# Altium project CircleValve.PrjPCB
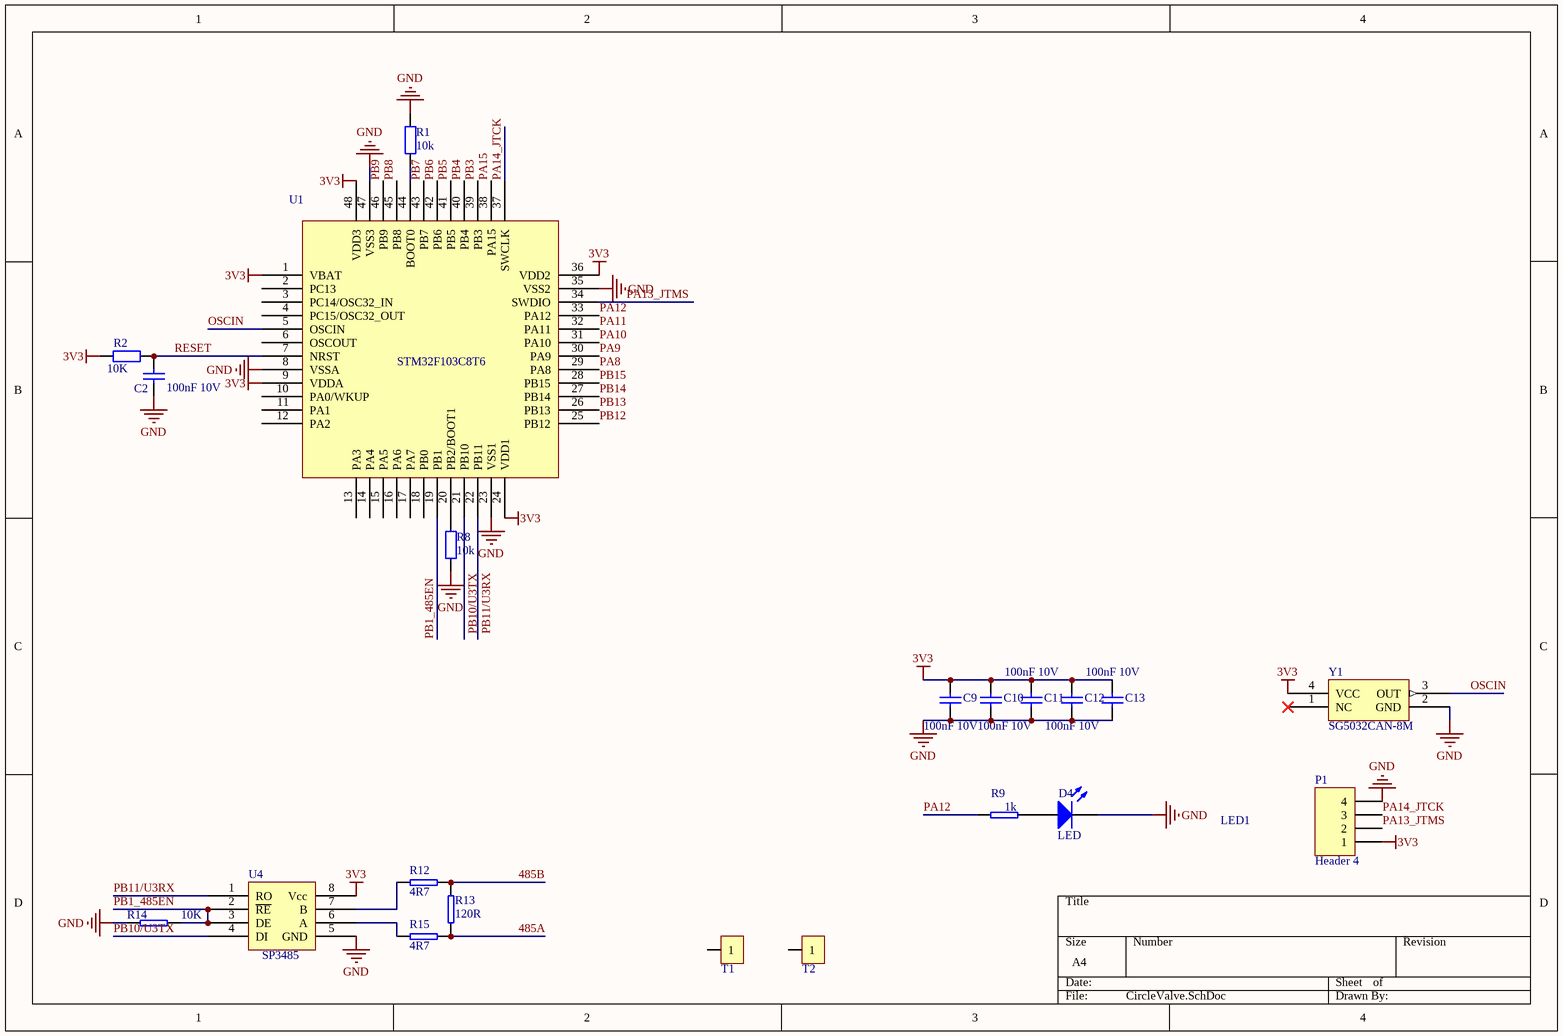
[diagram p0: CircleValve.SchDoc]
3 sheets, 53 parts. Net scope: global (net labels, ports and power ports of the same name join across sheets).
Board file: CircleValve.PcbDoc
Sheets:
  CircleValve.SchDoc
  Surface V2.0.SchDoc
  Power.SchDoc

## Sheet CircleValve.SchDoc
size A4

### Parts
C2  100nF 10V  [C0603]
C9  100nF 10V  [C0603]
C10  100nF 10V  [C0603]
C11  100nF 10V  [C0603]
C12  100nF 10V  [C0603]
C13  100nF 10V  [C0603]
D4  LED  [LED_M]
P1  Header 4  [Header4-2.54mm]
R1  10k  [R0603]
R2  10K  [R0603]
R8  10k  [R0603]
R9  1k  [R0603]
R12  4R7  [R0603]
R13  120R  [R0603]
R14  10K  [R0603]
R15  4R7  [R0603]
T1  TP  [定位孔3mm]  (value not drawn)
T2  TP  [定位孔3mm]  (value not drawn)
U1  STM32F103C8T6  [LQFP-48_7x7x05P]
U4  SP3485  [SO8]
Y1  SG5032CAN-8M  [XTAL-4P-5*3MM]

### Nets
3V3: C9.2 C10.2 C11.2 C12.2 C13.2 P1.1 R2.1 U1.1(VBAT) U1.9(VDDA) U1.24(VDD1) U1.36(VDD2) U1.48(VDD3) U4.8(Vcc) Y1.4(VCC)
GND: C2.2 C9.1 C10.1 C11.1 C12.1 C13.1 D4.2(K) P1.4 R1.2 R8.1 R14.1 U1.8(VSSA) U1.23(VSS1) U1.35(VSS2) U1.47(VSS3) U4.5(GND) Y1.2(GND)
485A: R13.2 R15.1
485B: R12.1 R13.1
OSCIN: U1.5(OSCIN) Y1.3(OUT)
PA8: U1.29(PA8)
PA9: U1.30(PA9)
PA10: U1.31(PA10)
PA11: U1.32(PA11)
PA12: R9.1 U1.33(PA12)
PA13_JTMS: P1.2 U1.34(SWDIO)
PA14_JTCK: P1.3 U1.37(SWCLK)
PA15: U1.38(PA15)
PB1_485EN: R14.2 U1.19(PB1) U4.2(~{RE}) U4.3(DE)
PB3: U1.39(PB3)
PB4: U1.40(PB4)
PB5: U1.41(PB5)
PB6: U1.42(PB6)
PB7: U1.43(PB7)
PB8: U1.45(PB8)
PB9: U1.46(PB9)
PB10/U3TX: U1.21(PB10) U4.4(DI)
PB11/U3RX: U1.22(PB11) U4.1(RO)
PB12: U1.25(PB12)
PB13: U1.26(PB13)
PB14: U1.27(PB14)
PB15: U1.28(PB15)
RESET: C2.1 R2.2 U1.7(NRST)
NetD4_1: D4.1(A) R9.2
NetR1_1: R1.1 U1.44(BOOT0)
NetR8_2: R8.2 U1.20(PB2/BOOT1)
NetR12_2: R12.2 U4.7(B)
NetR15_2: R15.2 U4.6(A)

Not connected (* = marked no-connect by the designer): T1 1; T2 1; U1 2(PC13) 3(PC14/OSC32_IN) 4(PC15/OSC32_OUT) 6(OSCOUT) 10(PA0/WKUP) 11(PA1) 12(PA2) 13(PA3) 14(PA4) 15(PA5) 16(PA6) 17(PA7) 18(PB0); Y1 1(NC)*

### Notes on the sheet
- LED1

### Library data of the parts
C2 C9-C13 = CAP
D4 = LED: 绿色
P1 = Header 4: Header, 4-Pin; LatestRevisionDate: 17-Jul-2002; LatestRevisionNote: Re-released for DXP Platform.; Publisher: Altium Limited
R1 R2 R8 = RES
R9 R12-R15 = R: 标贴电阻
U4 = RS485
Y1 = XTAL_POWER: 贴片有源晶振-8M

## Sheet Surface V2.0.SchDoc
size A4
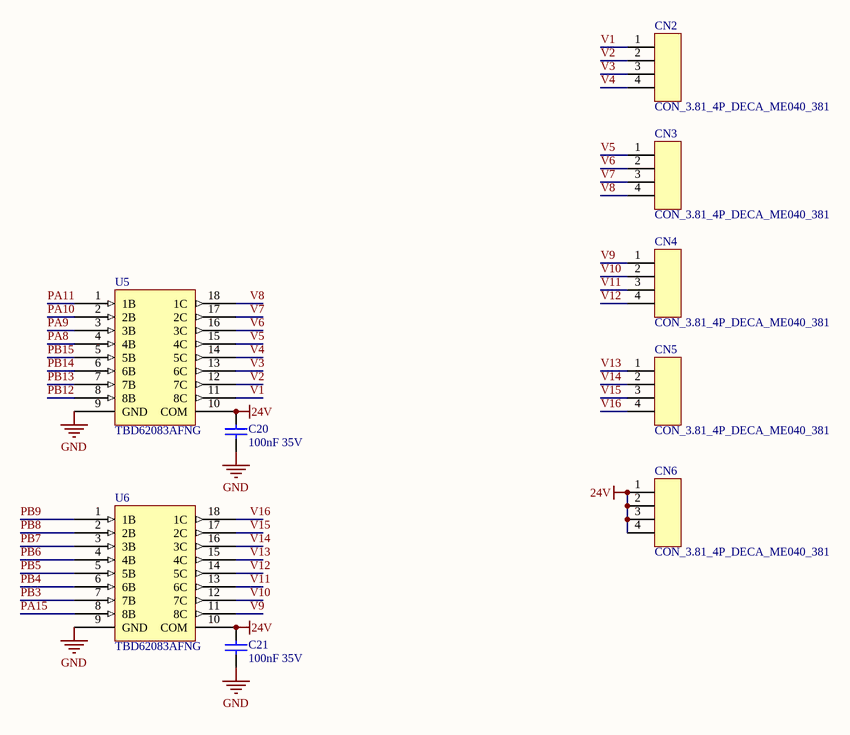
[diagram p1: Surface V2.0.SchDoc]

### Parts
C20  100nF 35V  [C0603]
C21  100nF 35V  [C0603]
CN2  CON_3.81_4P_DECA_ME040_381  [ME040_381_4P_VC-1]
CN3  CON_3.81_4P_DECA_ME040_381  [ME040_381_4P_VC-1]
CN4  CON_3.81_4P_DECA_ME040_381  [ME040_381_4P_VC-1]
CN5  CON_3.81_4P_DECA_ME040_381  [ME040_381_4P_VC-1]
CN6  CON_3.81_4P_DECA_ME040_381  [ME040_381_4P_VC-1]
U5  TBD62083AFNG  [SSOP18-0.65]
U6  TBD62083AFNG  [SSOP18-0.65]

### Nets
24V: C20.2 C21.2 CN6.1 CN6.2 CN6.3 CN6.4 U5.10(COM) U6.10(COM)
GND: C20.1 C21.1 U5.9(GND) U6.9(GND)
PA8: U5.4(4B)
PA9: U5.3(3B)
PA10: U5.2(2B)
PA11: U5.1(1B)
PA15: U6.8(8B)
PB3: U6.7(7B)
PB4: U6.6(6B)
PB5: U6.5(5B)
PB6: U6.4(4B)
PB7: U6.3(3B)
PB8: U6.2(2B)
PB9: U6.1(1B)
PB12: U5.8(8B)
PB13: U5.7(7B)
PB14: U5.6(6B)
PB15: U5.5(5B)
V1: CN2.1 U5.11(8C)
V2: CN2.2 U5.12(7C)
V3: CN2.3 U5.13(6C)
V4: CN2.4 U5.14(5C)
V5: CN3.1 U5.15(4C)
V6: CN3.2 U5.16(3C)
V7: CN3.3 U5.17(2C)
V8: CN3.4 U5.18(1C)
V9: CN4.1 U6.11(8C)
V10: CN4.2 U6.12(7C)
V11: CN4.3 U6.13(6C)
V12: CN4.4 U6.14(5C)
V13: CN5.1 U6.15(4C)
V14: CN5.2 U6.16(3C)
V15: CN5.3 U6.17(2C)
V16: CN5.4 U6.18(1C)

### Library data of the parts
C20 C21 = CAP
CN2-CN6 = CON_3.81_4P_DECA_ME040_381: DECA connector,3.81mm,1*4P,180度; PartNumber: ME040-381-4P; Manufacturer: DECA
U5 U6 = ULN2803: 达林顿晶体管阵列

## Sheet Power.SchDoc
size A4
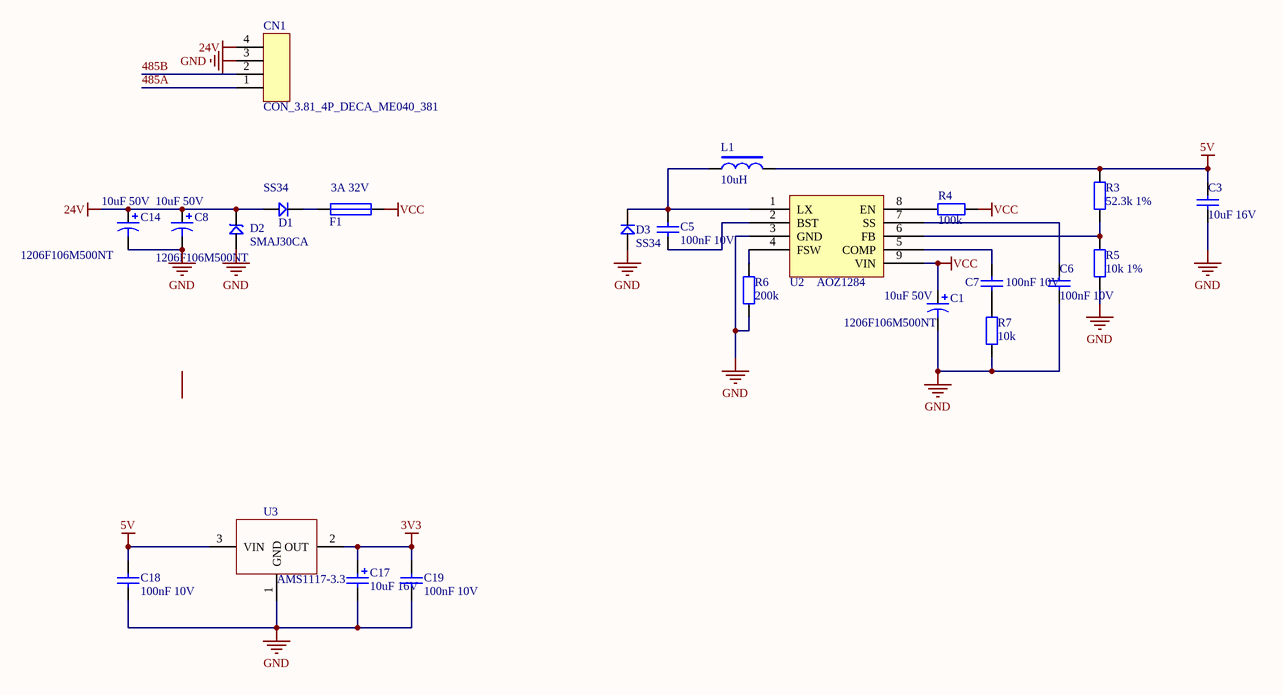
[diagram p2: Power.SchDoc]

### Parts
C1  10uF 50V  名称: 1206F106M500NT  [C1206]
C3  10uF 16V  [C1206]
C5  100nF 10V  [C0603]
C6  100nF 10V  [C0603]
C7  100nF 10V  [C0603]
C8  10uF 50V  名称: 1206F106M500NT  [C1206]
C14  10uF 50V  名称: 1206F106M500NT  [C1206]
C17  10uF 16V  [C1206]
C18  100nF 10V  [C0603]
C19  100nF 10V  [C0603]
CN1  CON_3.81_4P_DECA_ME040_381  [ME040_381_4P_VC-1]
D1  SS34  [LC-SMA(DO-214AC)_S3]
D2  SMAJ30CA  [LC-SMA(DO-214AC)_S3]
D3  SS34  [LC-SMA(DO-214AC)_S3]
F1  3A 32V  [C1206]
L1  10uH  [L_SOP74]
R3  52.3k 1%  [R0603]
R4  100k  [R0603]
R5  10k 1%  [R0603]
R6  200k  [R0603]
R7  10k  [R0603]
U2  AOZ1284  [LC-SOP-8_150mil]
U3  AMS1117-3.3  [LT1117]

### Nets
3V3: C17.1 C19.2 U3.2(OUT)
5V: C3.1 C18.2 L1.2 R3.2 U3.3(VIN)
24V: C8.1 C14.1 CN1.4 D1.1 D2.2
GND: C1.2 C3.2 C6.2 C8.2 C14.2 C17.2 C18.1 C19.1 CN1.3 D2.1 D3.1 R5.1 R6.1 R7.1 U2.3(GND) U3.1(GND)
VCC: C1.1 F1.2 R4.2 U2.9(VIN)
485A: CN1.1
485B: CN1.2
NetC5_1: C5.1 U2.2(BST)
NetC5_2: C5.2 D3.2 L1.1 U2.1(LX)
NetC6_1: C6.1 U2.7(SS)
NetC7_1: C7.1 U2.5(COMP)
NetC7_2: C7.2 R7.2
NetD1_2: D1.2 F1.1
NetR3_1: R3.1 R5.2 U2.6(FB)
NetR4_1: R4.1 U2.8(EN)
NetR6_2: R6.2 U2.4(FSW)

### Library data of the parts
C1 C8 C14 = Cap Pol1: 贴片陶瓷电容; Value: 220uF/50V 8*12; Published: 8-Jun-2000; LatestRevisionDate: 17-Jul-2002; LatestRevisionNote: Re-released for DXP Platform.; PackageReference: RB7.6-15; Publisher: Altium Limited; PackageDescription: Polarized Capacitor (Radial); 2 Leads
C3 = CAP: 贴片陶瓷电容
C5-C7 C18 C19 = CAP
C17 = CAP1: 贴片陶瓷电容
CN1 = CON_3.81_4P_DECA_ME040_381: as CN2 on sheet Surface V2.0; Manufacturer: DECA
D1 D3 = D
D2 = SMBJ: TVS
F1 = FUSE
L1 = 差模电感: 贴片电感7*7mm
R3-R7 = RES
U3 = LT1117

## Nets that join several sheets
3V3: CircleValve (14 pins), Power (C17.1 C19.2 U3.2)
24V: Surface V2.0 (8 pins), Power (5 pins)
GND: CircleValve (17 pins), Surface V2.0 (C20.1 C21.1 U5.9 U6.9), Power (16 pins)
485A: CircleValve (R13.2 R15.1), Power (CN1.1)
485B: CircleValve (R12.1 R13.1), Power (CN1.2)
PA8: CircleValve (U1.29), Surface V2.0 (U5.4)
PA9: CircleValve (U1.30), Surface V2.0 (U5.3)
PA10: CircleValve (U1.31), Surface V2.0 (U5.2)
PA11: CircleValve (U1.32), Surface V2.0 (U5.1)
PA15: CircleValve (U1.38), Surface V2.0 (U6.8)
PB3: CircleValve (U1.39), Surface V2.0 (U6.7)
PB4: CircleValve (U1.40), Surface V2.0 (U6.6)
PB5: CircleValve (U1.41), Surface V2.0 (U6.5)
PB6: CircleValve (U1.42), Surface V2.0 (U6.4)
PB7: CircleValve (U1.43), Surface V2.0 (U6.3)
PB8: CircleValve (U1.45), Surface V2.0 (U6.2)
PB9: CircleValve (U1.46), Surface V2.0 (U6.1)
PB12: CircleValve (U1.25), Surface V2.0 (U5.8)
PB13: CircleValve (U1.26), Surface V2.0 (U5.7)
PB14: CircleValve (U1.27), Surface V2.0 (U5.6)
PB15: CircleValve (U1.28), Surface V2.0 (U5.5)